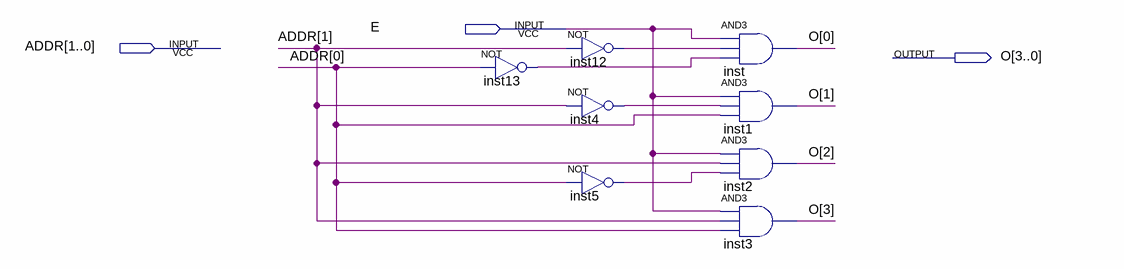
[diagram p0: schematic sheet]
// Quartus schematic Decoder2to4.bdf as structural Verilog: 8 symbols, 3 pins
module Decoder2to4 (
  input  E,
  input  [1:0] ADDR,
  output [3:0] O
);

  wire inst4_out, inst5_out, inst12_out, inst13_out;

  not inst13 (inst13_out, ADDR[0]);
  not inst12 (inst12_out, ADDR[1]);
  not inst4 (inst4_out, ADDR[1]);
  not inst5 (inst5_out, ADDR[0]);
  and inst (O[0], E, inst12_out, inst13_out);
  and inst1 (O[1], E, inst4_out, ADDR[0]);
  and inst2 (O[2], E, ADDR[1], inst5_out);
  and inst3 (O[3], E, ADDR[1], ADDR[0]);
endmodule
